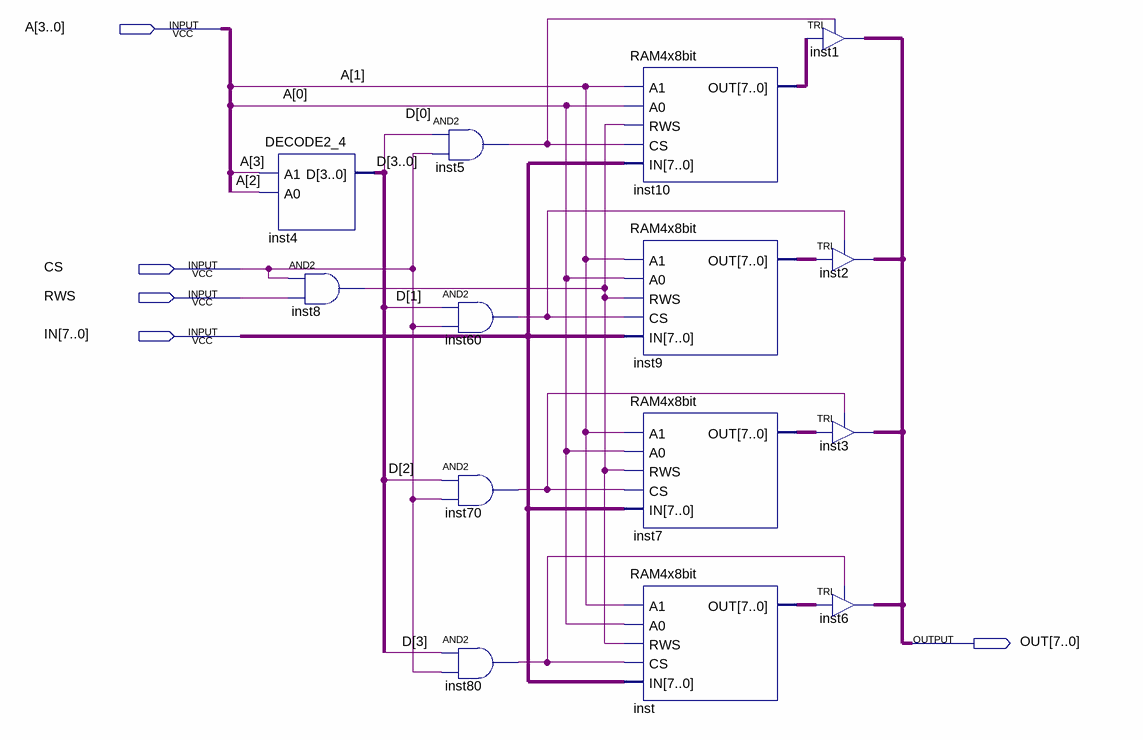
[diagram p0: schematic sheet]
// Quartus schematic RAM16x8bit.bdf as structural Verilog: 14 symbols, 5 pins
module RAM16x8bit (
  input  [3:0] A,
  input  CS,
  input  RWS,
  input  [7:0] IN,
  output [7:0] OUT
);

  wire inst5_out, inst8_out, inst60_out, inst70_out, inst80_out;
  wire [3:0] D;
  wire [7:0] inst7_out, inst9_out, inst10_out, inst_out;

  DECODE2_4 inst4 (.A1(A[3]), .A0(A[2]), .D(D));
  and inst8 (inst8_out, CS, RWS);
  and inst5 (inst5_out, D[0], CS);
  and inst60 (inst60_out, D[1], CS);
  and inst70 (inst70_out, D[2], CS);
  and inst80 (inst80_out, D[3], CS);
  RAM4x8bit inst10 (.A1(A[1]), .A0(A[0]), .RWS(inst8_out), .CS(inst5_out), .IN(IN), .OUT(inst10_out));
  RAM4x8bit inst9 (.A1(A[1]), .A0(A[0]), .RWS(inst8_out), .CS(inst60_out), .IN(IN), .OUT(inst9_out));
  RAM4x8bit inst7 (.A1(A[1]), .A0(A[0]), .RWS(inst8_out), .CS(inst70_out), .IN(IN), .OUT(inst7_out));
  RAM4x8bit inst (.A1(A[1]), .A0(A[0]), .RWS(inst8_out), .CS(inst80_out), .IN(IN), .OUT(inst_out));
  TRI inst1[7:0] (.IN(inst10_out), .OE(inst5_out), .OUT(OUT));
  TRI inst2[7:0] (.IN(inst9_out), .OE(inst60_out), .OUT(OUT));
  TRI inst3[7:0] (.IN(inst7_out), .OE(inst70_out), .OUT(OUT));
  TRI inst6[7:0] (.IN(inst_out), .OE(inst80_out), .OUT(OUT));
endmodule
